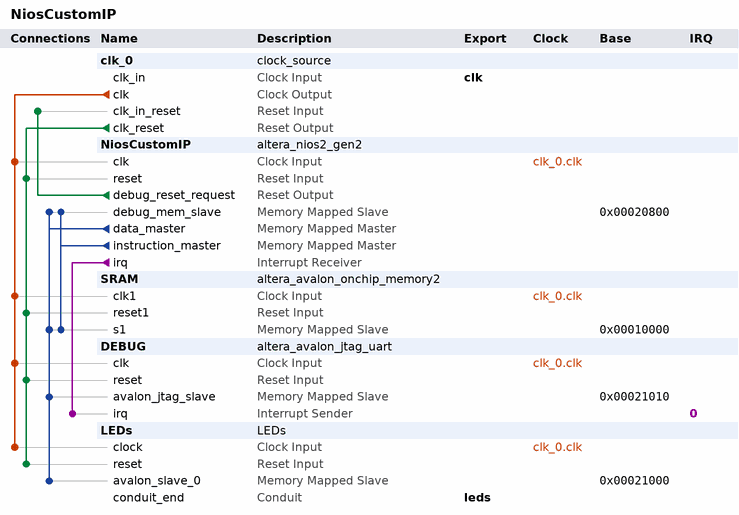
[diagram p0: system contents]
# Platform Designer (Qsys) system NiosCustomIP, MAX 10 10M50DAF484C6GES
# Parameters at their usual value, and those the tool derives, are not listed.
package require -exact qsys 22.1
create_system NiosCustomIP
set_project_property DEVICE_FAMILY {MAX 10}
set_project_property DEVICE 10M50DAF484C6GES

add_instance clk_0 clock_source 22.1
set_instance_parameter_value clk_0 clockFrequency 50000000

add_instance NiosCustomIP altera_nios2_gen2 22.1
set_instance_parameter_value NiosCustomIP dcache_size 2048
set_instance_parameter_value NiosCustomIP exceptionSlave SRAM.s1
set_instance_parameter_value NiosCustomIP icache_size 4096
set_instance_parameter_value NiosCustomIP impl Fast
set_instance_parameter_value NiosCustomIP resetSlave SRAM.s1

add_instance SRAM altera_avalon_onchip_memory2 22.1
set_instance_parameter_value SRAM dataWidth 32
set_instance_parameter_value SRAM dualPort false
set_instance_parameter_value SRAM initMemContent true
set_instance_parameter_value SRAM initializationFileName onchip_mem.hex
set_instance_parameter_value SRAM memorySize 40960

add_instance DEBUG altera_avalon_jtag_uart 22.1
set_instance_parameter_value DEBUG simInteractiveOptions NO_INTERACTIVE_WINDOWS

add_instance LEDs LEDs 1.0

# connections
add_connection clk_0.clk DEBUG.clk clock
add_connection clk_0.clk LEDs.clock clock
add_connection clk_0.clk NiosCustomIP.clk clock
add_connection clk_0.clk SRAM.clk1 clock
add_connection clk_0.clk_reset DEBUG.reset reset
add_connection clk_0.clk_reset LEDs.reset reset
add_connection clk_0.clk_reset NiosCustomIP.reset reset
add_connection clk_0.clk_reset SRAM.reset1 reset
add_connection NiosCustomIP.debug_reset_request clk_0.clk_in_reset reset
add_connection NiosCustomIP.data_master DEBUG.avalon_jtag_slave avalon
set_connection_parameter_value NiosCustomIP.data_master/DEBUG.avalon_jtag_slave baseAddress 0x00021010
add_connection NiosCustomIP.data_master LEDs.avalon_slave_0 avalon
set_connection_parameter_value NiosCustomIP.data_master/LEDs.avalon_slave_0 baseAddress 0x00021000
add_connection NiosCustomIP.data_master NiosCustomIP.debug_mem_slave avalon
set_connection_parameter_value NiosCustomIP.data_master/NiosCustomIP.debug_mem_slave baseAddress 0x00020800
add_connection NiosCustomIP.data_master SRAM.s1 avalon
set_connection_parameter_value NiosCustomIP.data_master/SRAM.s1 baseAddress 0x00010000
add_connection NiosCustomIP.instruction_master NiosCustomIP.debug_mem_slave avalon
set_connection_parameter_value NiosCustomIP.instruction_master/NiosCustomIP.debug_mem_slave baseAddress 0x00020800
add_connection NiosCustomIP.instruction_master SRAM.s1 avalon
set_connection_parameter_value NiosCustomIP.instruction_master/SRAM.s1 baseAddress 0x00010000
add_connection NiosCustomIP.irq DEBUG.irq interrupt
set_connection_parameter_value NiosCustomIP.irq/DEBUG.irq irqNumber 0

# exported interfaces
add_interface clk clock sink
set_interface_property clk EXPORT_OF clk_0.clk_in
add_interface leds conduit end
set_interface_property leds EXPORT_OF LEDs.conduit_end

set_interconnect_requirement {$system} qsys_mm.clockCrossingAdapter HANDSHAKE
set_interconnect_requirement {$system} qsys_mm.enableEccProtection FALSE
set_interconnect_requirement {$system} qsys_mm.insertDefaultSlave FALSE
set_interconnect_requirement {$system} qsys_mm.maxAdditionalLatency 1

save_system NiosCustomIP.qsys
